# Altium schematic sheet CPU.SchDoc
size A4
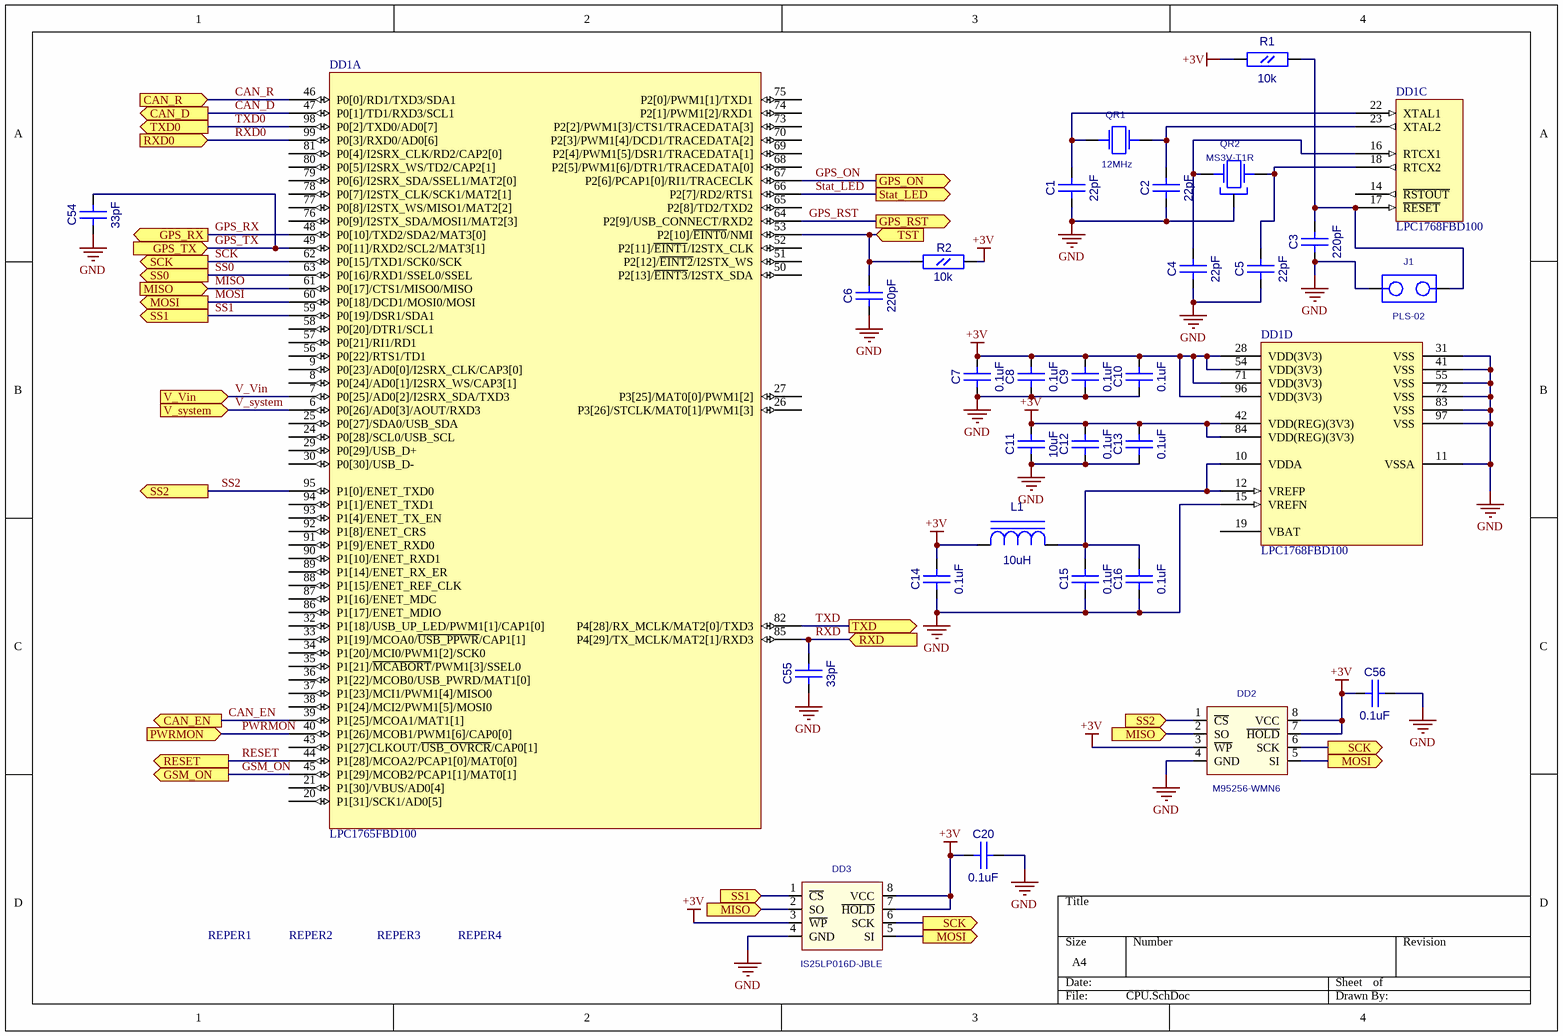
[diagram p0: CPU.SchDoc]

## Parts
C1  22pF  [CC0603]
C2  22pF  [CC0603]
C3  220pF  [CC0603]
C4  22pF  [CC0603]
C5  22pF  [CC0603]
C6  220pF  [CC0603]
C7  0.1uF  [CC0603]
C8  0.1uF  [CC0603]
C9  0.1uF  [CC0603]
C10  0.1uF  [CC0603]
C11  10uF  [CC0805]
C12  0.1uF  [CC0603]
C13  0.1uF  [CC0603]
C14  0.1uF  [CC0603]
C15  0.1uF  [CC0603]
C16  0.1uF  [CC0603]
C20  0.1uF  [CC0603]
C54  33pF  [CC0603]
C55  33pF  [CC0603]
C56  0.1uF  [CC0603]
DD1  LPC1765FBD100  [TQFP-100]  (parts A,C,D of 4)
DD2  M95256-WMN6  [SO-8]
DD3  IS25LP016D-JBLE  [EIAJ_SO8]
J1  PLS-02  [PLS-02]
L1  10uH  [L0603]
QR1  12MHz  [AC5032_2]
QR2  MS3V-T1R  [MS3V-T1R]
R1  10k  [RC0603]
R2  10k  [RC0603]
REPER1  REPER1.2  [REPER1.2]  (value not drawn)
REPER2  REPER1.2  [REPER1.2]  (value not drawn)
REPER3  REPER1.2  [REPER1.2]  (value not drawn)
REPER4  REPER1.2  [REPER1.2]  (value not drawn)

## Ports
CAN_D (out), CAN_EN (out), CAN_R (in), GPS_ON (out), GPS_RST (out), GPS_RX (out), GPS_TX (in), GSM_ON (out), MISO (in), MOSI (out), PWRMON (in), RESET (out), RXD0 (in), RXD (in), SCK (out), SS0 (out), SS1 (in), SS1 (out), SS2 (in), SS2 (out), Stat_LED (out), TST (in), TXD0 (out), TXD (out), V_system (in), V_Vin (in)

## Nets
+3V: C7.2(B) C8.2(B) C9.2(B) C10.2(B) C11.2(B) C12.2(B) C13.2(B) C14.2(B) C20.1(A) C56.1(A) DD1.28(VDD(3V3)) DD1.42(VDD(REG)(3V3)) DD1.54(VDD(3V3)) DD1.71(VDD(3V3)) DD1.84(VDD(REG)(3V3)) DD1.96(VDD(3V3)) DD2.3(~{WP}) DD2.7(~{HOLD}) DD2.8(VCC) DD3.3(~{WP}) DD3.7(~{HOLD}) DD3.8(VCC) L1.1(A) R1.1(A) R2.1(A)
GND: C1.1(A) C2.1(A) C3.1(A) C4.1(A) C5.1(A) C6.1(A) C7.1(A) C8.1(A) C9.1(A) C10.1(A) C11.1(A) C12.1(A) C13.1(A) C14.1(A) C15.1(A) C16.1(A) C20.2(B) C54.1(A) C55.1(A) C56.2(B) DD1.11(VSSA) DD1.15(VREFN) DD1.31(VSS) DD1.41(VSS) DD1.55(VSS) DD1.72(VSS) DD1.83(VSS) DD1.97(VSS) DD2.4(GND) DD3.4(GND) J1.1 QR2.3
CAN_D: DD1.47(P0[1]/TD1/RXD3/SCL1) ; port CAN_D
CAN_EN: DD1.39(P1[25]/MCOA1/MAT1[1]) ; port CAN_EN
CAN_R: DD1.46(P0[0]/RD1/TXD3/SDA1) ; port CAN_R
GPS_ON: DD1.67(P2[6]/PCAP1[0]/RI1/TRACECLK) ; port GPS_ON
GPS_RST: DD1.64(P2[9]/USB_CONNECT/RXD2) ; port GPS_RST
GPS_RX: DD1.48(P0[10]/TXD2/SDA2/MAT3[0]) ; port GPS_RX
GPS_TX: C54.2(B) DD1.49(P0[11]/RXD2/SCL2/MAT3[1]) ; port GPS_TX
GSM_ON: DD1.45(P1[29]/MCOB2/PCAP1[1]/MAT0[1]) ; port GSM_ON
MISO: DD1.61(P0[17]/CTS1/MISO0/MISO) DD2.2(SO) DD3.2(SO) ; port MISO
MOSI: DD1.60(P0[18]/DCD1/MOSI0/MOSI) DD2.5(SI) DD3.5(SI) ; port MOSI
PWRMON: DD1.40(P1[26]/MCOB1/PWM1[6]/CAP0[0]) ; port PWRMON
RESET: DD1.44(P1[28]/MCOA2/PCAP1[0]/MAT0[0]) ; port RESET
RXD: C55.2(B) DD1.85(P4[29]/TX_MCLK/MAT2[1]/RXD3) ; port RXD
RXD0: DD1.99(P0[3]/RXD0/AD0[6]) ; port RXD0
SCK: DD1.62(P0[15]/TXD1/SCK0/SCK) DD2.6(SCK) DD3.6(SCK) ; port SCK
SS0: DD1.63(P0[16]/RXD1/SSEL0/SSEL) ; port SS0
SS1: DD1.59(P0[19]/DSR1/SDA1) DD3.1(~{CS}) ; port SS1
SS2: DD1.95(P1[0]/ENET_TXD0) DD2.1(~{CS}) ; port SS2
Stat_LED: DD1.66(P2[7]/RD2/RTS1) ; port Stat_LED
TST: C6.2(B) DD1.53(P2[10]/~{EINT0}/NMI) R2.2(B) ; port TST
TXD: DD1.82(P4[28]/RX_MCLK/MAT2[0]/TXD3) ; port TXD
TXD0: DD1.98(P0[2]/TXD0/AD0[7]) ; port TXD0
V_system: DD1.6(P0[26]/AD0[3]/AOUT/RXD3) ; port V_system
V_Vin: DD1.7(P0[25]/AD0[2]/I2SRX_SDA/TXD3) ; port V_Vin
NetC1_2: C1.2(B) DD1.22(XTAL1) QR1.1
NetC2_2: C2.2(B) DD1.23(XTAL2) QR1.2
NetC3_2: C3.2(B) DD1.17(~{RESET}) J1.2 R1.2(B)
NetC4_2: C4.2(B) DD1.16(RTCX1) QR2.2(X2)
NetC5_2: C5.2(B) DD1.18(RTCX2) QR2.1(X1)
NetC15_2: C15.2(B) C16.2(B) DD1.10(VDDA) DD1.12(VREFP) L1.2(C)

Not connected (* = marked no-connect by the designer): DD1 8(P0[24]/AD0[1]/I2SRX_WS/CAP3[1]) 9(P0[23]/AD0[0]/I2SRX_CLK/CAP3[0]) 14(~{RSTOUT}) 19(VBAT) 20(P1[31]/SCK1/AD0[5]) 21(P1[30]/VBUS/AD0[4]) 24(P0[28]/SCL0/USB_SCL) 25(P0[27]/SDA0/USB_SDA) 26(P3[26]/STCLK/MAT0[1]/PWM1[3]) 27(P3[25]/MAT0[0]/PWM1[2]) 29(P0[29]/USB_D+) 30(P0[30]/USB_D-) 32(P1[18]/USB_UP_LED/PWM1[1]/CAP1[0]) 33(P1[19]/MCOA0/~{USB_PPWR}/CAP1[1]) 34(P1[20]/MCI0/PWM1[2]/SCK0) 35(P1[21]/~{MCABORT}/PWM1[3]/SSEL0) 36(P1[22]/MCOB0/USB_PWRD/MAT1[0]) 37(P1[23]/MCI1/PWM1[4]/MISO0) 38(P1[24]/MCI2/PWM1[5]/MOSI0) 43(P1[27]CLKOUT/~{USB_OVRCR}/CAP0[1]) 50(P2[13]/~{EINT3}/I2STX_SDA) 51(P2[12]/~{EINT2}/I2STX_WS) 52(P2[11]/~{EINT1}/I2STX_CLK) 56(P0[22]/RTS1/TD1) 57(P0[21]/RI1/RD1) 58(P0[20]/DTR1/SCL1) 65(P2[8]/TD2/TXD2) 68(P2[5]/PWM1[6]/DTR1/TRACEDATA[0]) 69(P2[4]/PWM1[5]/DSR1/TRACEDATA[1]) 70(P2[3]/PWM1[4]/DCD1/TRACEDATA[2]) 73(P2[2]/PWM1[3]/CTS1/TRACEDATA[3]) 74(P2[1]/PWM1[2]/RXD1) 75(P2[0]/PWM1[1]/TXD1) 76(P0[9]/I2STX_SDA/MOSI1/MAT2[3]) 77(P0[8]/I2STX_WS/MISO1/MAT2[2]) 78(P0[7]/I2STX_CLK/SCK1/MAT2[1]) 79(P0[6]/I2SRX_SDA/SSEL1/MAT2[0]) 80(P0[5]/I2SRX_WS/TD2/CAP2[1]) 81(P0[4]/I2SRX_CLK/RD2/CAP2[0]) 86(P1[17]/ENET_MDIO) 87(P1[16]/ENET_MDC) 88(P1[15]/ENET_REF_CLK) 89(P1[14]/ENET_RX_ER) 90(P1[10]/ENET_RXD1) 91(P1[9]/ENET_RXD0) 92(P1[8]/ENET_CRS) 93(P1[4]/ENET_TX_EN) 94(P1[1]/ENET_TXD1); REPER1 1; REPER2 1; REPER3 1; REPER4 1

## Library data of the parts
C1-C10 C12-C16 C20 C54-C56 = CC0603
  C1 C2 C4 C5: Value: 22pF
  C3 C6: Value: 220pF
  C7-C10 C12-C16 C20 C56: Value: 0.1uF
  C54 C55: Value: 33pF
C11 = CC0805: Value: 10uF
DD1 = LPC1768FBD100: Cortex -M3 32-Bit Microcontroller, 512KB Flash, 64KB RAM, 100-Lead LQFP; ComponentLink1Description: Manufacturer Link; ComponentLink1URL: http://www.nxp.com/
DD2 = M95256-WMN6: SPI EEPROM; Value: *
DD3 = S25FL016A0LMFI01: Value: IS25LP016D-JBLE
L1 = L0603: Value: 10uH
QR1 = AC5032_2: AC5032/2; Value: 12MHz
QR2 = MS3V-T1R: CRYSTAL_32768 Hz; Value: *
R1 R2 = RC0603: Value: 10k
J1 = PLS-02: Value: *
REPER1-REPER4 = REPER1.2: Value: *